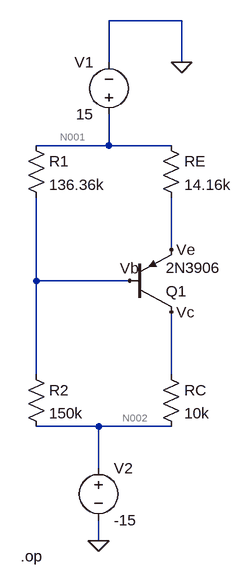
[diagram p0: schematic part1.asc]
part1.asc, the LTspice schematic file:
Version 4.1
SHEET 1 880 680
WIRE 336 -224 224 -224
WIRE 224 -160 224 -224
WIRE 336 -160 336 -224
WIRE 224 -32 224 -80
WIRE 224 -32 112 -32
WIRE 320 -32 224 -32
WIRE 320 128 320 48
WIRE 112 176 112 48
WIRE 256 176 112 176
WIRE 112 320 112 176
WIRE 320 320 320 224
WIRE 208 400 112 400
WIRE 320 400 208 400
WIRE 208 464 208 400
WIRE 208 576 208 544
FLAG 208 576 0
FLAG 336 -160 0
FLAG 320 128 Ve
FLAG 256 176 Vb
FLAG 320 224 Vc
SYMBOL res 304 -48 R0
SYMATTR InstName RE
SYMATTR Value 14.16k
SYMBOL res 304 304 R0
SYMATTR InstName RC
SYMATTR Value 10k
SYMBOL res 96 -48 R0
SYMATTR InstName R1
SYMATTR Value 136.36k
SYMBOL res 96 304 R0
SYMATTR InstName R2
SYMATTR Value 150k
SYMBOL pnp 256 224 M180
SYMATTR InstName Q1
SYMATTR Value 2N3906
SYMBOL voltage 208 448 R0
SYMATTR InstName V2
SYMATTR Value -15
SYMBOL voltage 224 -64 R180
WINDOW 0 24 96 Left 2
WINDOW 3 24 16 Left 2
SYMATTR InstName V1
SYMATTR Value 15
TEXT 88 600 Left 2 !.op

The netlist it stands for:
* part1.asc
RE N001 Ve 14.16k
RC Vc N002 10k
R1 N001 Vb 136.36k
R2 Vb N002 150k
Q1 Vc Vb Ve 0 2N3906
V2 N002 0 -15
V1 N001 0 15
.model NPN NPN
.model PNP PNP
.lib standard.bjt
.op
.backanno
.end

* Results of the author's LTspice run, read from the files saved beside the schematic
* Operating Point:
*   V(ve) = 1.681 V
*   V(n002) = -15 V
*   V(vb) = 1.029 V
*   V(n001) = 15 V
*   V(vc) = -5.638 V
*   I(RE) = 940.6 µA
*   Ic(Q1) = -936.2 µA
*   Ib(Q1) = -4.398 µA
*   Ie(Q1) = 940.6 µA
*   Is(Q1) = 0 A
*   I(R1) = 102.5 µA
*   I(V2) = 1.043 mA
*   I(R2) = 106.9 µA
*   I(V1) = -1.043 mA
*   I(RC) = 936.2 µA